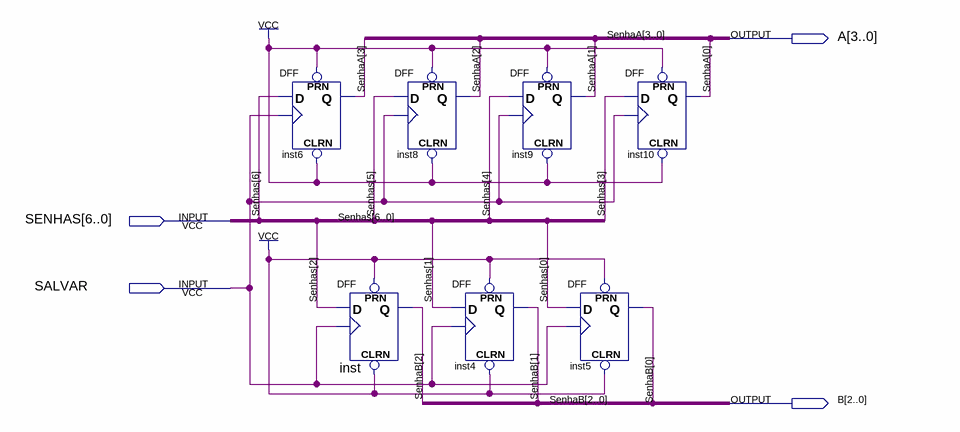
[diagram p0: schematic sheet]
// Quartus schematic Armazenamento.bdf as structural Verilog: 7 symbols, 4 pins
module Armazenamento (
  input  [6:0] SENHAS,
  input  SALVAR,
  output [3:0] A,
  output [2:0] B
);

  DFF inst6 (.CLRN(1'b1), .CLK(SALVAR), .D(SENHAS[6]), .PRN(1'b1), .Q(A[3]));
  DFF inst (.CLRN(1'b1), .CLK(SALVAR), .D(SENHAS[2]), .PRN(1'b1), .Q(B[2]));
  DFF inst8 (.CLRN(1'b1), .CLK(SALVAR), .D(SENHAS[5]), .PRN(1'b1), .Q(A[2]));
  DFF inst9 (.CLRN(1'b1), .CLK(SALVAR), .D(SENHAS[4]), .PRN(1'b1), .Q(A[1]));
  DFF inst4 (.CLRN(1'b1), .CLK(SALVAR), .D(SENHAS[1]), .PRN(1'b1), .Q(B[1]));
  DFF inst5 (.CLRN(1'b1), .CLK(SALVAR), .D(SENHAS[0]), .PRN(1'b1), .Q(B[0]));
  DFF inst10 (.CLRN(1'b1), .CLK(SALVAR), .D(SENHAS[3]), .PRN(1'b1), .Q(A[0]));

  // Other names for the same wires on the sheet: SenhaB[2:0] = B; SenhaA[3:0] = A
endmodule
